# EAGLE schematic NOT_Gate (EAGLE 7.1.0)
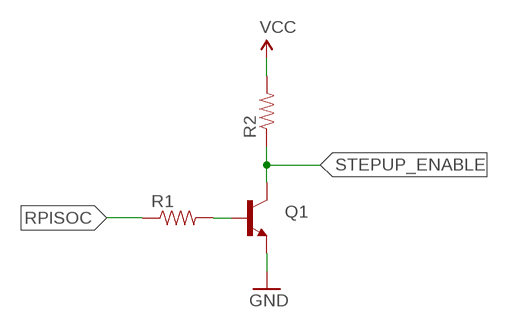
[diagram p0: schematic, sheet 1]

## Parts
Q1  TRANSISTOR_NPN2N3904  [TO-92]
R1  RESISTOR0603  [0603-RES]
R2  RESISTOR0603  [0603-RES]

## Nets
GND: Q1.1(E)
N$1: Q1.2(B) R1.2
RPISOC: R1.1
STEPUP_ENABLE: Q1.3(C) R2.1
VCC: R2.2

## Library data of the parts
Q1 = SparkFun-DiscreteSemi:TRANSISTOR_NPN: Generic NPN BJT MMBT2222A - TRANS-08049 (SOT-23, 1A 40V) MPSA42 - TRANS-09116 (SOT-23, 500mA 300V) MMBT5088LT1G - TRANS-11160 (SOT-23, 50 mA 30V) BC547 - COM-08928 <http://www.sparkfun.com/products/8928> (TO-92 45V 100mA) (1.Collector 2.Base 3.Emitter) 2N3904 - COM-00521 <http://www.sparkfun.com/products/521> (TO-92 40V 200mA) (1.Emitter 2.Base 3.Collector) P2N2222A - COM-12852 <http://www.sparkfun.com/products/12852> (TO-92 40V 600mA) (1.Collector 2.Base 3.Emitter); PROD_ID: TRANS-08447
R1 R2 = SparkFun-Resistors:RESISTOR: Resistor Basic schematic elements and footprints for 0603, 1206, and PTH resistors.